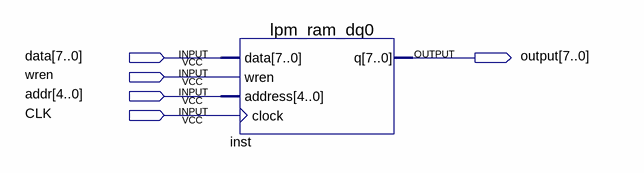
[diagram p0: schematic sheet]
// Quartus schematic ram.bdf as structural Verilog: 1 symbols, 5 pins
module ram (
  input  [7:0] data,
  input  wren,
  input  [4:0] addr,
  input  CLK,
  output [7:0] \output 
);

  lpm_ram_dq0 inst (.data(data), .wren(wren), .address(addr), .clock(CLK), .q(\output ));
endmodule
